# EAGLE schematic simple-hat (EAGLE 6.6.0)
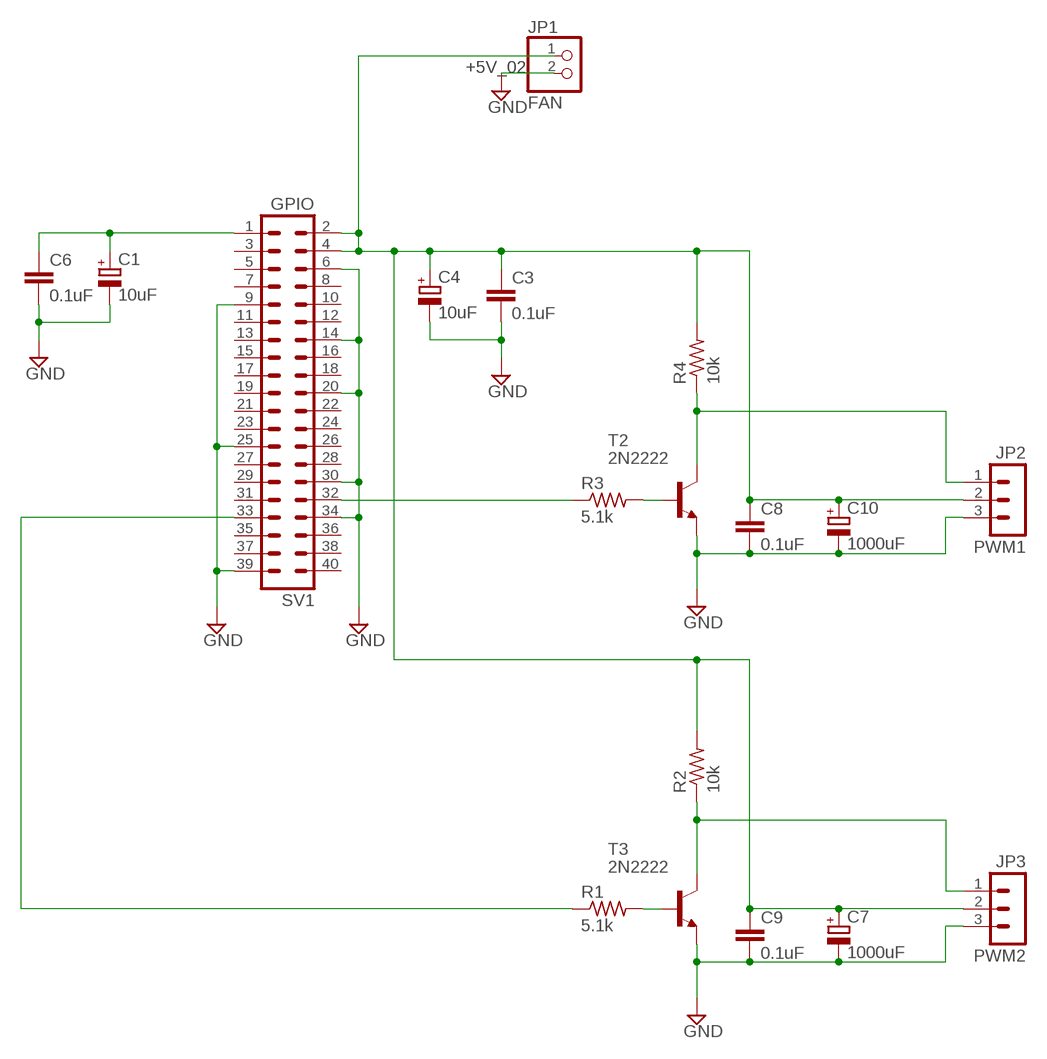
[diagram p0: schematic, sheet 1]

## Parts
C1  10uF  CPOL-EUE2-5  [E2-5]
C3  0.1uF  C-EU025-025X050  [C025-025X050]
C4  10uF  CPOL-EUE2-5  [E2-5]
C6  0.1uF  C-EU025-025X050  [C025-025X050]
C7  1000uF  CPOL-EUE5-10.5  [E5-10,5]
C8  0.1uF  C-EU025-025X050  [C025-025X050]
C9  0.1uF  C-EU025-025X050  [C025-025X050]
C10  1000uF  CPOL-EUE5-10.5  [E5-10,5]
JP1  FAN  PINHD-1X2  [1X02]
PWM1  JP2  MA03-1  [MA03-1]
PWM2  JP3  MA03-1  [MA03-1]
R1  5.1k  R-US_0207/7  [0207/7]
R2  10k  R-US_0207/7  [0207/7]
R3  5.1k  R-US_0207/7  [0207/7]
R4  10k  R-US_0207/7  [0207/7]
SV1  GPIO  MA20-2  [MA20-2]
T2  2N2222  -NPN-TO92-EBC  [TO92-EBC]
T3  2N2222  -NPN-TO92-EBC  [TO92-EBC]

## Nets
+5V_02 [Power]: C3.1 C4.+ C7.+ C8.1 C9.1 C10.+ JP1.1 PWM1.2 PWM2.2 R2.2 R4.2 SV1.2 SV1.4
GND [GND]: C1.- C3.2 C4.- C6.2 C7.- C8.2 C9.2 C10.- JP1.2 PWM1.3 PWM2.3 SV1.6 SV1.9 SV1.14 SV1.20 SV1.25 SV1.30 SV1.34 SV1.39 T2.E T3.E
N$2: C1.+ C6.1 SV1.1
N$3: R1.1 SV1.33
N$4: R3.1 SV1.32
N$6: R3.2 T2.B
N$7: PWM1.1 R4.1 T2.C
N$9: R1.2 T3.B
N$10: PWM2.1 R2.1 T3.C
Unconnected: SV1.3 SV1.5 SV1.7 SV1.8 SV1.10 SV1.11 SV1.12 SV1.13 SV1.15 SV1.16 SV1.17 SV1.18 SV1.19 SV1.21 SV1.22 SV1.23 SV1.24 SV1.26 SV1.27 SV1.28 SV1.29 SV1.31 SV1.35 SV1.36 SV1.37 SV1.38 SV1.40

## Library data of the parts
C1 C4 C7 C10 = resistor:CPOL-EU: POLARIZED CAPACITOR, European symbol
C3 C6 C8 C9 = resistor:C-EU: CAPACITOR, European symbol
JP1 = pinhead:PINHD-1X2: PIN HEADER
PWM1 PWM2 = con-lstb:MA03-1: PIN HEADER; OC_FARNELL: unknown; OC_NEWARK: unknown
R1-R4 = resistor:R-US_: RESISTOR, American symbol
SV1 = con-lstb:MA20-2: PIN HEADER; OC_FARNELL: unknown; OC_NEWARK: unknown
T2 T3 = transistor:*-NPN-: NPN Transistror BF959 corrected 2008.03.06

## Net classes
0 default: width 0.61 mm, clearance 0.508 mm
1 Power: width 0.914 mm, clearance 0.508 mm
2 GND: width 0.813 mm, clearance 0.508 mm